# EAGLE design untitled (EAGLE 4.16)
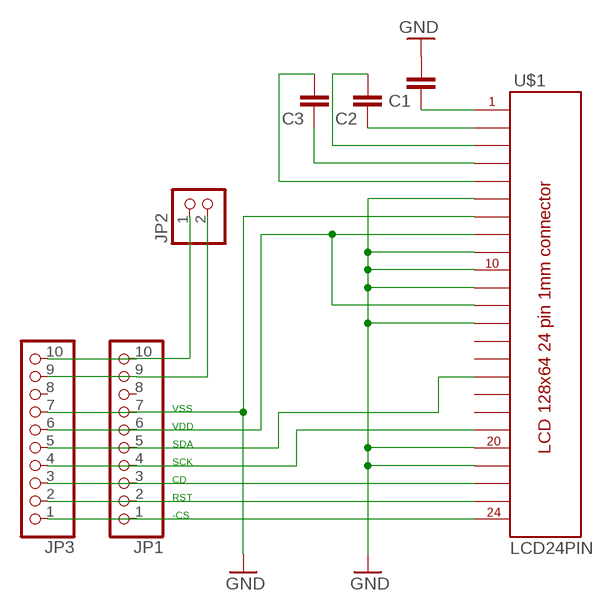
[diagram p0: schematic, sheet 1]

## Parts
C1  C-EUC1206  [C1206]
C2  C-EUC1206  [C1206]
C3  C-EUC1206  [C1206]
JP1  PINHD-1X10  [1X10]
JP2  PINHD-1X2  [1X02]
JP3  PINHD-1X10  [1X10]
U$1  LCD24PIN  [LCD24PIN]

## Nets
GND: C1.2 JP1.7 JP3.7 U$1.P$6 U$1.P$7 U$1.P$9 U$1.P$10 U$1.P$11 U$1.P$13 U$1.P$20 U$1.P$21
N$1: C2.1 U$1.P$2
N$2: C2.2 U$1.P$3
N$3: C3.1 U$1.P$4
N$4: C3.2 U$1.P$5
N$5: C1.1 U$1.P$1
N$6: JP1.1 JP3.1 U$1.P$24
N$7: JP1.2 JP3.2 U$1.P$23
N$8: JP1.3 JP3.3 U$1.P$22
N$9: JP1.4 JP3.4 U$1.P$19
N$10: JP1.5 JP3.5 U$1.P$16
N$13: JP1.10 JP2.1 JP3.10
N$14: JP1.9 JP2.2 JP3.9
N$22: JP1.6 JP3.6 U$1.P$8 U$1.P$12
Unconnected: JP1.8 JP3.8 U$1.P$14 U$1.P$15 U$1.P$17 U$1.P$18

## Notes on the sheet
- VSS
- VDD
- SDA
- SCK
- CD
- RST
- -CS

## Library data of the parts
C1-C3 = rcl:C-EU: CAPACITOR, European symbol
JP1 JP3 = pinhead:PINHD-1X10: PIN HEADER
JP2 = pinhead:PINHD-1X2: PIN HEADER
U$1 = jacek:LCD24PIN

## Board
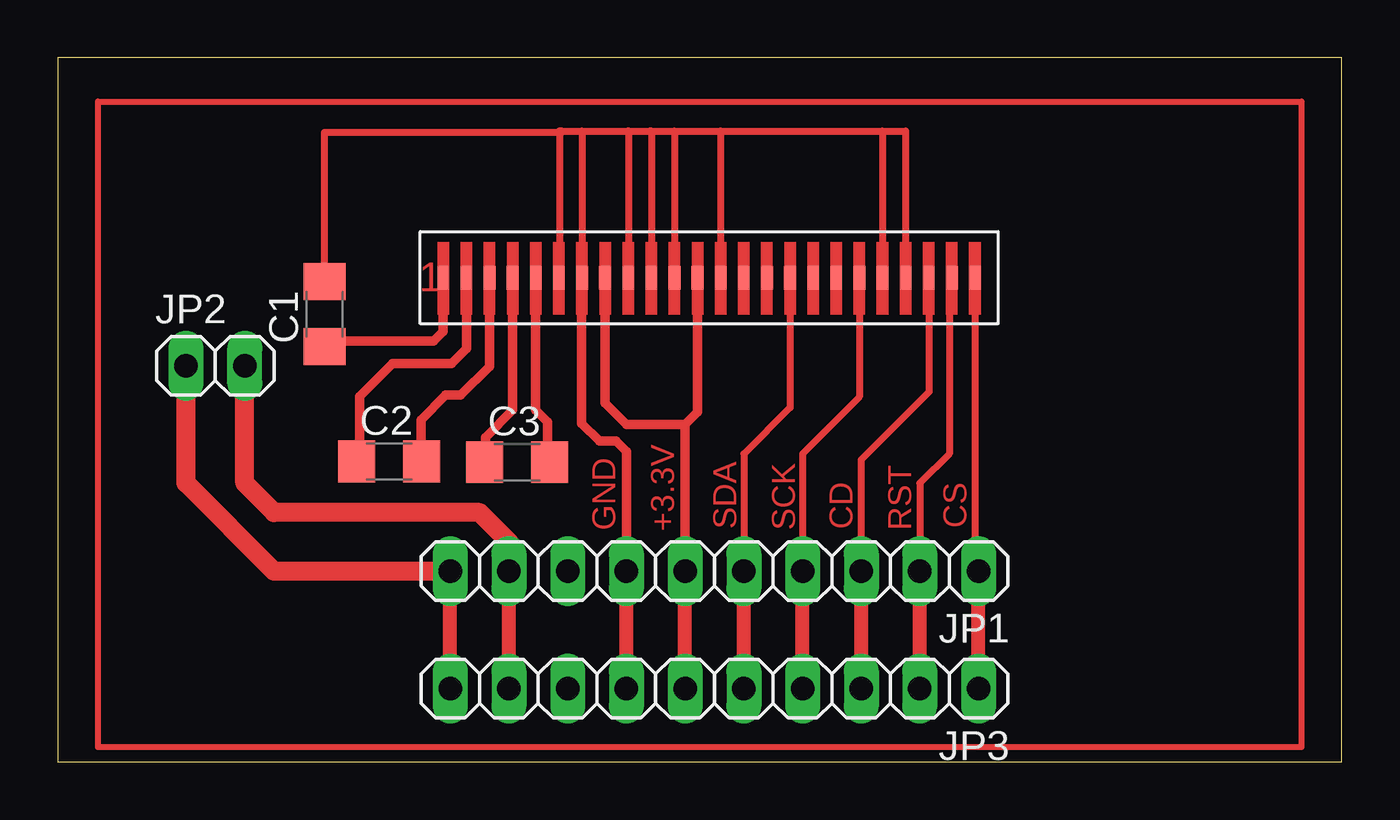
[diagram p1: board, top side]

Size 55.55 x 30.47 mm. Coordinates in mm from the lower left corner, seen from the top.
Outline: 0,0 55.55,0 55.55,30.47 0,30.47 0,0
Copper layers (1*16): Top 0.035mm / dielectric 1.5mm / Bottom 0.035mm
Design rules "default": minimum track width 10mil, minimum drill 24mil, track to track 8mil, track to pad 8mil, pad to pad 8mil, via to via 8mil, smd to smd 8mil, copper to edge 40mil, drill to drill 8mil, minimum pad ring 10mil, minimum via ring 8mil, stop-mask expansion 4mil, vias tented up to drill 0mil, thermal gap 10mil

### Footprints (pad centres in the part's own frame; a part is rotated, then mirrored left to right if it is on the bottom)
C1206 = smd 1.6 x 1.8: 1 -1.4,0; 2 1.4,0
1X10 = drill 1.016 long: 1 -11.43,0; 2 -8.89,0; 3 -6.35,0; 4 -3.81,0; 5 -1.27,0; 6 1.27,0; 7 3.81,0; 8 6.35,0; 9 8.89,0; 10 11.43,0
1X02 = drill 1.016 long: 1 -1.27,0; 2 1.27,0
LCD24PIN = smd 0.508 x 1.016: P$1 -13,0; P$2 -12,0; P$3 -11,0; P$4 -10,0; P$5 -9,0; P$6 -8,0; P$7 -7,0; P$8 -6,0; P$9 -5,0; P$10 -4,0; P$11 -3,0; P$12 -2,0; P$13 -1,0; P$14 0,0; P$15 1,0; P$16 2,0; P$17 3,0; P$18 4,0; P$19 5,0; P$20 6,0; P$21 7,0; P$22 8,0; P$23 9,0; P$24 10,0

### Placement (x,y rotation side)
C1  11.54,19.38 90 top
C2  14.34,13 0 top
C3  19.88,12.97 0 top
JP1  28.41,8.25 180 top
JP2  6.82,17.14 0 top
JP3  28.41,3.17 180 top
U$1  29.68,20.95 0 top

### Tracks (layer width: path | path; a pad name or v marks a point on that pad's centre or on a via)
GND
  Top 0.305: U$1.P$11 26.68,27.3 | 25.67,20.95 U$1.P$10 25.68,27.3 25.62,27.3 | U$1.P$9 24.7,20.95 24.7,27.3 24.65,27.3 | U$1.P$21 36.68,27.3 35.67,27.3 | 21.81,27.3 21.7,27.3 21.7,20.8 21.68,20.8 U$1.P$6 | 21.81,27.3 22.67,27.3 | 22.67,27.3 24.65,27.3 | 24.65,27.3 25.62,27.3 | 25.62,27.3 26.68,27.3 | 26.68,27.3 28.66,27.3 | 28.66,27.3 35.67,27.3 | 35.67,27.3 35.67,27.25 35.68,27.25 U$1.P$20 | U$1.P$13 28.68,27.3 28.66,27.3 | U$1.P$7 22.68,27.3 22.67,27.3 | 21.81,27.3 21.81,27.25 11.54,27.25 C1.2
  Top 0.406: 24.6,8.15 24.4,7.94 | 24.6,8.15 JP1.7 24.6,13.43 24.14,13.89 23.43,13.89 22.67,14.65 22.67,20.75 22.68,20.76 U$1.P$7 | 24.6,8.15 24.65,8.2
  Top 0.61: JP3.7 JP1.7
N$1
  Top 0.406: U$1.P$2 17.68,17.89 17.03,17.24 14.49,17.24 13.07,15.82 13.07,13.23 12.87,13.03 12.89,13 C2.1
N$2
  Top 0.406: U$1.P$3 18.68,17.11 17.44,15.87 16.78,15.87 15.71,14.8 15.71,13.08 15.79,13 | 15.81,12.97 15.79,13 | 15.79,13 C2.2
N$3
  Top 0.406: U$1.P$4 19.68,15.22 18.5,14.04 18.5,12.92 18.48,12.89 | 18.45,12.87 18.48,12.89 | 18.48,12.89 C3.1
N$4
  Top 0.406: U$1.P$5 20.68,15.22 21.2,14.7 21.2,13.03 21.25,12.97 C3.2
N$5
  Top 0.406: U$1.P$1 16.68,18.62 16.27,18.21 11.8,18.21 11.57,17.97 C1.1
N$6
  Top 0.305: U$1.P$24 39.68,8.25 JP1.1
  Top 0.61: JP3.1 JP1.1
N$7
  Top 0.305: U$1.P$23 38.57,20.95 38.57,13.33 37.3,12.06 JP1.2
  Top 0.61: JP3.2 JP1.2
N$8
  Top 0.305: JP1.3 34.76,13.08 37.71,16.02 37.71,20.9 37.66,20.95 U$1.P$22
  Top 0.406: JP1.3 34.71,8.2
  Top 0.61: JP3.3 JP1.3
N$9
  Top 0.305: U$1.P$19 34.68,15.79 32.22,13.33 JP1.4
  Top 0.406: JP1.4 32.22,8.2
  Top 0.61: JP3.4 JP1.4
N$10
  Top 0.305: U$1.P$16 31.68,15.33 29.68,13.33 JP1.5
  Top 0.406: JP1.5 29.58,8.15
  Top 0.61: JP3.5 JP1.5
N$11
  Top 0.254: 1.74,28.57 53.81,28.57 53.81,0.63 1.74,0.63 1.74,28.57
N$13
  Top 0.61: JP3.10 JP1.10
  Top 0.813: JP1.10 9.36,8.25 5.55,12.06 JP2.1
N$14
  Top 0.61: JP3.9 JP1.9
  Top 0.813: JP1.9 19.52,9.52 18.25,10.79 9.36,10.79 8.09,12.06 JP2.2
N$22
  Top 0.406: U$1.P$8 23.68,15.52 24.6,14.6 27.14,14.6 | JP1.6 27.14,14.6 | U$1.P$12 27.68,15.14 27.14,14.6
  Top 0.61: JP3.6 JP1.6

### Text on the board
Top: GND | +3.3V | SDA | SCK | CD | RST | CS